# Altium schematic sheet 10-BUS_SENS.SchDoc: TEMPERATURE
size A4; Author: Alexandre Cosneau; CompanyName: Tristar Multicopters; DrawnBy: Alexandre Cosneau; Engineer: Alexandre Cosneau; Organization: Tristar Multicopters; Address1: Genie / GEGI; Address2: 2500 boulevard de l'universite; Address3: J1K2R SHERBROOKE; Address4: QUEBEC, CANADA; DocumentNumber: 5; Revision: 1.0; SheetNumber: 5; SheetTotal: 7
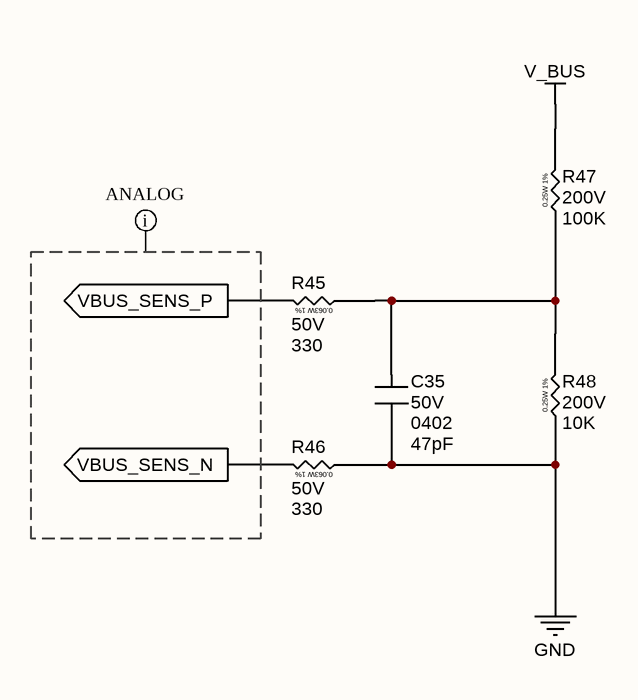
[diagram p0: 10-BUS_SENS.SchDoc]

## Parts
C35  VDC: 50V  Package: 0402  [C 0402(1005)x0.5]  (hidden comment: 47pF)
R45  VDC: 50V  [R 0402(1005)-1%]  (hidden comment: 330)
R46  VDC: 50V  [R 0402(1005)-1%]  (hidden comment: 330)
R47  VDC: 200V  [R 1210(3225)-1%]  (hidden comment: 100K)
R48  VDC: 200V  [R 1210(3225)-1%]  (hidden comment: 10K)

## Ports
VBUS_SENS_N (out), VBUS_SENS_P (out)

## Nets
GND: C35.2 R46.1 R48.1
V_BUS: R47.2
VBUS_SENS_N: R46.2 ; port VBUS_SENS_N
VBUS_SENS_P: R45.2 ; port VBUS_SENS_P
NetC35_1: C35.1 R45.1 R47.1 R48.2

## Layout directives
net class ANALOG: (no net found under the mark)

## Notes on the sheet
- Title:
- Size:
- Date:
- A
- Revision:
- Time:
- Author:
- Sheet
- of
- File:
- (in symbol RES 0402-1%) 0.063W 1%
- (in symbol RES 1206-1%) 0.25W 1%

## Library data of the parts
C35 = CAP 0402 100nF 50V X7R: SMD-0402 100nF 50V X7R 10%; Part Number: CL05B104KB5NNNC; Manufacturer: Samsung; TYPE: Capacitors; Package-mm: 1005; Mount Type: SMT; Publisher: Hefest; Manufacturer Alternate: *; Part Number Alternate: *; Published: 07.04.2019; Supplier 1: Comet; Supplier 2: *; Supplier 3: *; Supplier Part Number 1: C0402 100nF 50V X7R; Supplier Part Number 2: *; Supplier Part Number 3: *; RoHS: Y; Technology: Ceramic  MLCC; Value 1: *; Value 2: *; TempCo: X7R; Tolerance %: ±10%; VAC: *; ESR Ohm: *; ComponentLink1Description: Datasheet link; ComponentLink1URL: https://store.comet.bg/download-file.php?id=11; Temperature Range: -55°C ~ +125°C; Price: 0.039; Value: 47pF
R45 R46 = RES 0402-1%: SMD 0402 0.063W 1% 50V; Manufacturer: YAGEO; TempCo: ±100ppm/°C; Package-mm: 1005; Value Code: 1001; Power: 0.0625W; Part Number: *; Mount Type: SMT; Publisher: Hefest; Manufacturer Alternate: *; Published: 07.04.2019; Supplier 1: Comet; Supplier 2: *; Supplier 3: *; Supplier Part Number 1: R0402 1.0K 1% YAG/ASJ; Supplier Part Number 2: *; Supplier Part Number 3: *; RoHS: Y; Technology: Thick film; Value 2: *; Package: 0402; Tolerance %: ±1%; ComponentLink1Description: Datasheet link; ComponentLink1URL: https://store.comet.bg/download-file.php?id=1224; Temperature Range: -55°C ~ +155°C; Price: 0.015; Part Number Alternate: *; TYPE: Resistor; Value 1: *; Value: 330
R47 R48 = RES 1206-1%: SMD 1206 0.25W  1% 200V; Manufacturer: YAGEO; TempCo: ±100ppm/°C; Package-mm: 3216; Value Code: 1001; Part Number: *; Mount Type: SMT; Publisher: Hefest; Manufacturer Alternate: *; Published: 07.04.2019; Supplier 1: Comet; Supplier 2: *; Supplier 3: *; Supplier Part Number 1: R1206 1.0K 1% YAG/ASJ; Supplier Part Number 2: *; Supplier Part Number 3: *; RoHS: Y; Technology: Thick film; Value 2: *; Package: 1206; Tolerance %: ±1%; ComponentLink1Description: Datasheet link; ComponentLink1URL: https://store.comet.bg/download-file.php?id=1224; Temperature Range: -55°C ~ +155°C; Price: 0.069; Part Number Alternate: *; TYPE: Resistor; Value 1: *; Power: 0.25W
  R47: Value: 100K
  R48: Value: 10K